# Altium schematic sheet TPS7333Q Breakout.SchDoc: 3.3V Power Supply
size Letter
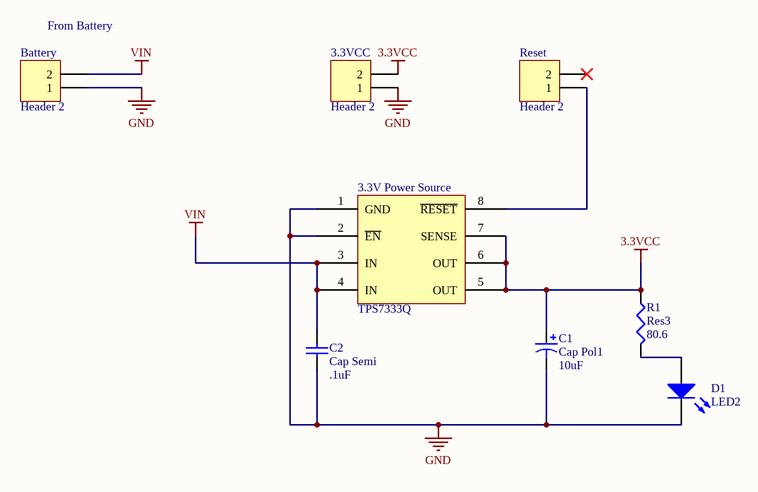
[diagram p0: TPS7333Q Breakout.SchDoc]

## Parts
3.3V_Power_Source  TPS7333Q  [SOIC127P600-8BN]
3.3VCC  Header 2  [HDR1X2]
Battery  Header 2  [HDR1X2]
C1  Cap Pol1  value 10uF  [TC7343-2917]
C2  Cap Semi  value .1uF  [CAPC2012N]
D1  LED2  [RESC3216N]
R1  Res3  value 80.6  [RESC2012N]
Reset  Header 2  [HDR1X2]

## Nets
3.3VCC: 3.3V_Power_Source.5(OUT) 3.3V_Power_Source.6(OUT) 3.3V_Power_Source.7(SENSE) 3.3VCC.2 C1.1 R1.1
GND: 3.3V_Power_Source.1(GND) 3.3V_Power_Source.2(~{EN}) 3.3VCC.1 Battery.1 C1.2 C2.1 D1.2(K)
VIN: 3.3V_Power_Source.3(IN) 3.3V_Power_Source.4(IN) Battery.2 C2.2
Net3.3V_Power_Source_8: 3.3V_Power_Source.8(~{RESET}) Reset.1
NetD1_1: D1.1(A) R1.2

Not connected (* = marked no-connect by the designer): Reset 2*

## Notes on the sheet
- (near Battery) From Battery
- Title
- Size:
- Date:
- Letter
- Number:
- Time:
- Revision:
- Sheet
- of
- File:

## Library data of the parts
3.3VCC Battery Reset = Header 2: Header, 2-Pin; LatestRevisionDate: 17-Jul-2002; LatestRevisionNote: Re-released for DXP Platform.; Publisher: Altium Limited
C1 = Cap Pol1: Polarized Capacitor (Radial); Published: 8-Jun-2000; LatestRevisionDate: 17-Jul-2002; LatestRevisionNote: Re-released for DXP Platform.; PackageReference: RB7.6-15; Publisher: Altium Limited; PackageDescription: Polarized Capacitor (Radial); 2 Leads
C2 = Cap Semi: Capacitor (Semiconductor SIM Model); Published: 8-Jun-2000; LatestRevisionDate: 29-May-2009; LatestRevisionNote: IPC-7351 Footprint Added.; PackageReference: C1206; Publisher: Altium Limited; PackageDescription: Chip Capacitor
D1 = LED2: Typical RED, GREEN, YELLOW, AMBER GaAs LED; Published: 8-Jun-2000; LatestRevisionDate: 17-Jul-2002; LatestRevisionNote: Re-released for DXP Platform.; PackageVersion: Feb-2002; PackageReference: 3.2X1.6X1.1; Publisher: Altium Limited; PackageDescription: SM LED; 2 Flat Leads
R1 = Res3: Resistor; Published: 8-Jun-2000; LatestRevisionDate: 29-May-2009; LatestRevisionNote: IPC-7351 Footprint Added.; PackageReference: J1-0603; Publisher: Altium Limited; PackageDescription: Chip Resistor